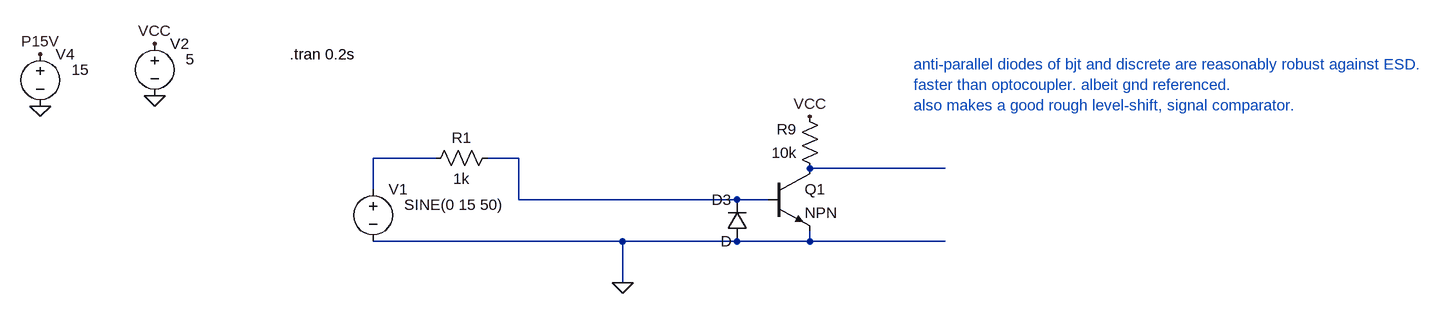
[diagram p0: schematic Draft01.asc]
Draft01.asc, the LTspice schematic file:
Version 4
SHEET 1 5720 1740
WIRE 1216 -256 1120 -256
WIRE 1344 -256 1296 -256
WIRE 2000 -240 1792 -240
WIRE 1120 -208 1120 -256
WIRE 1344 -192 1344 -256
WIRE 1680 -192 1344 -192
WIRE 1728 -192 1680 -192
WIRE 1504 -128 1120 -128
WIRE 1680 -128 1504 -128
WIRE 1792 -128 1792 -144
WIRE 1792 -128 1680 -128
WIRE 2000 -128 1792 -128
WIRE 1504 -64 1504 -128
FLAG 784 -352 0
FLAG 784 -432 VCC
FLAG 608 -336 0
FLAG 608 -416 P15V
FLAG 1792 -320 VCC
FLAG 1504 -64 0
SYMBOL voltage 784 -448 R0
WINDOW 123 0 0 Left 0
WINDOW 39 0 0 Left 0
WINDOW 3 48 40 Left 2
SYMATTR Value 5
SYMATTR InstName V2
SYMBOL voltage 608 -432 R0
WINDOW 123 0 0 Left 0
WINDOW 39 0 0 Left 0
WINDOW 3 48 40 Left 2
SYMATTR Value 15
SYMATTR InstName V4
SYMBOL voltage 1120 -224 R0
WINDOW 123 0 0 Left 0
WINDOW 39 0 0 Left 0
WINDOW 3 48 40 Left 2
SYMATTR Value SINE(0 15 50)
SYMATTR InstName V1
SYMBOL res 1312 -272 R90
WINDOW 0 0 56 VBottom 2
WINDOW 3 32 56 VTop 2
SYMATTR InstName R1
SYMATTR Value 1k
SYMBOL npn 1728 -240 R0
SYMATTR InstName Q1
SYMBOL diode 1696 -128 R180
WINDOW 0 24 64 Left 2
WINDOW 3 24 0 Left 2
SYMATTR InstName D3
SYMBOL res 1808 -224 R180
WINDOW 0 36 76 Left 2
WINDOW 3 36 40 Left 2
SYMATTR InstName R9
SYMATTR Value 10k
TEXT 992 -416 Left 2 !.tran 0.2s
TEXT 1952 -400 Left 2 ;anti-parallel diodes of bjt and discrete are reasonably robust against ESD.\nfaster than optocoupler. albeit gnd referenced.\nalso makes a good rough level-shift, signal comparator.

The netlist it stands for:
* Draft01.asc
V2 VCC 0 5
V4 P15V 0 15
V1 N001 0 SINE(0 15 50)
R1 N002 N001 1k
Q1 N003 N002 0 0 NPN
D3 0 N002 D
R9 N003 VCC 10k
.model D D
.lib standard.dio
.model NPN NPN
.model PNP PNP
.lib standard.bjt
.tran 0.2s
* anti-parallel diodes of bjt and discrete are reasonably robust against ESD.
* faster than optocoupler. albeit gnd referenced.
* also makes a good rough level-shift, signal comparator.
.backanno
.end